# Altium schematic sheet 0030.SchDoc
size A4
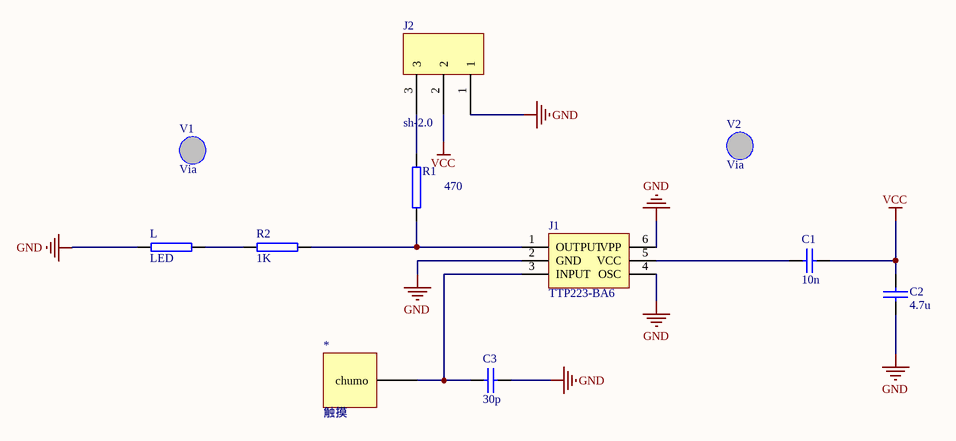
[diagram p0: 0030.SchDoc]

## Parts
*  触摸  [触摸]
C1  10n  [0402]
C2  4.7u  [0805]
C3  30p  [0402]
J1  TTP223-BA6  [SOT-23-6]
J2  sh-2.0  [sh-2.0]
L  LED  [0402]
R1  470  [0402]
R2  1K  [0402]
V1  Via  [Via]
V2  Via  [Via]

## Nets
GND: C2.2 C3.2 J1.2(GND) J1.4(OSC) J1.6(VPP) J2.1 L.1
VCC: C1.2 C2.1 J2.2
Net*_?1: *.?1(chumo) C3.1 J1.3(INPUT)
NetC1_1: C1.1 J1.5(VCC)
NetJ1_1: J1.1(OUTPUT) R1.2 R2.2
NetJ2_3: J2.3 R1.1
NetL_2: L.2 R2.1

## Library data of the parts
C1 C3 = CAP0402
C2 = cap0603
L R1 R2 = RES0402